# EAGLE design trigger_pickoff (EAGLE 9.2.2)
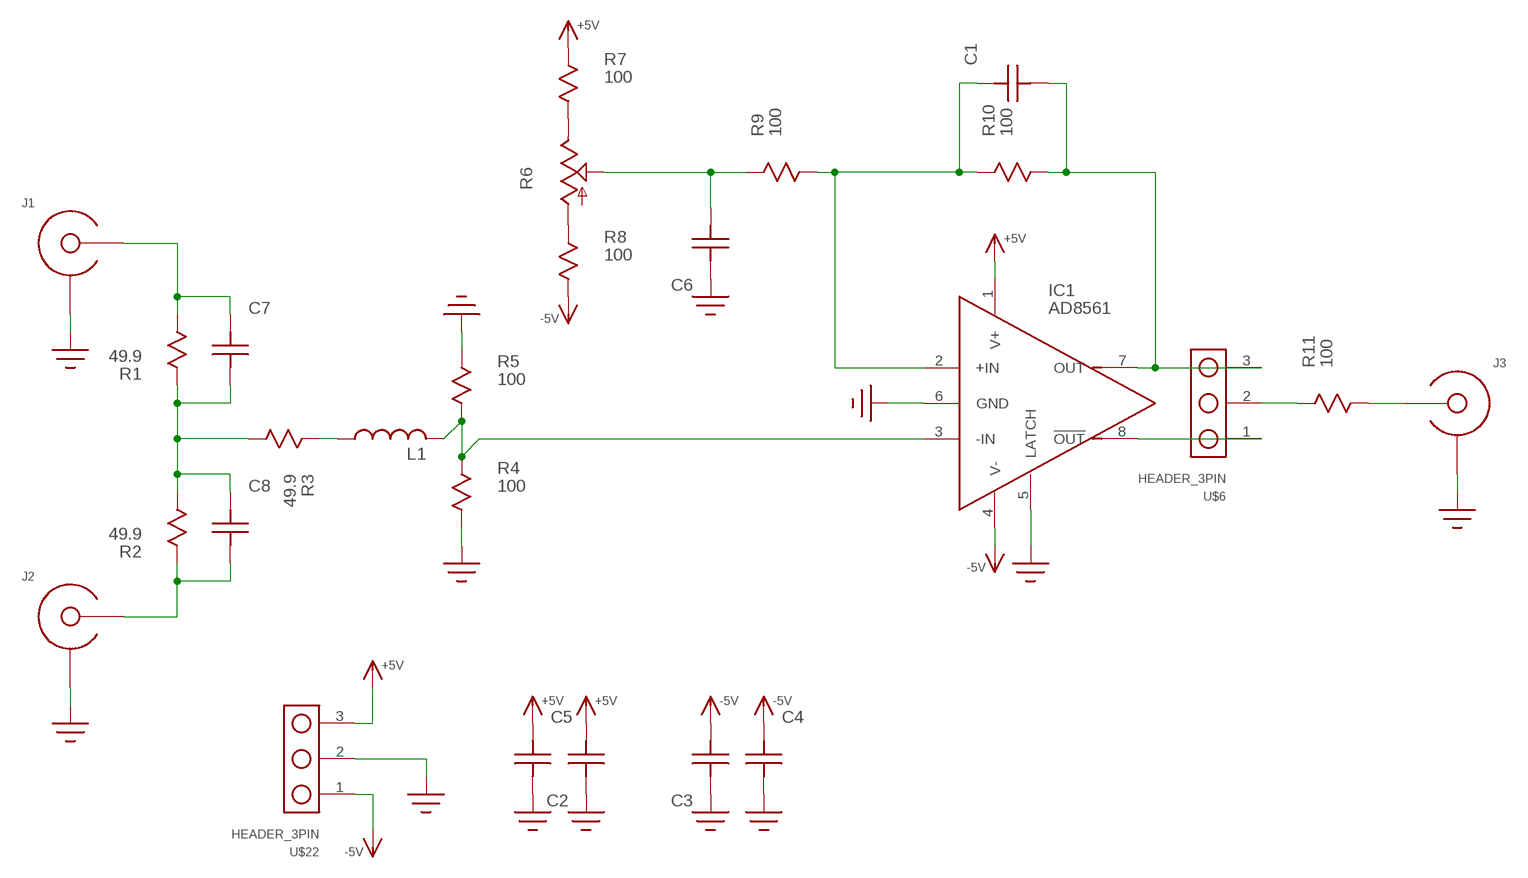
[diagram p0: schematic, sheet 1]

## Parts
C1  C0603  [C0603]
C2  C0603  [C0603]
C3  C0603  [C0603]
C4  C0805  [0805]
C5  C0805  [0805]
C6  C0603  [C0603]
C7  C0603  [C0603]
C8  C0603  [C0603]
IC1  AD8561  [SOIC8]
J1  EDGE_LAUNCH_JACK  [EDGE_LAUNCH_RF_CON]
J2  EDGE_LAUNCH_JACK  [EDGE_LAUNCH_RF_CON]
J3  EDGE_LAUNCH_JACK  [EDGE_LAUNCH_RF_CON]
L1  INDUCTOR  [R0603]
R1  49.9  R0603  [R0603]
R2  49.9  R0603  [R0603]
R3  49.9  R0603  [R0603]
R4  100  R0603  [R0603]
R5  100  R0603  [R0603]
R6  TRIM_US-SP19L  [SP19L]
R7  100  R0603  [R0603]
R8  100  R0603  [R0603]
R9  100  R0603  [R0603]
R10  100  R0603  [R0603]
R11  100  R0603  [R0603]
U$6  HEADER_3PIN  [HEADER_3PIN]
U$22  HEADER_3PIN  [HEADER_3PIN]

## Nets
+5V: C2.P$1 C5.P$2 IC1.1(V+) R7.P$1 U$22.3
-5V: C3.P$1 C4.P$2 IC1.4(V-) R8.P$2 U$22.1
GND: C2.P$2 C3.P$2 C4.P$1 C5.P$1 C6.P$2 IC1.5(LATCH) IC1.6(GND) J1.GND@1(SHIELD) J1.GND@2(SHIELD) J1.GND@3(SHIELD) J1.GND@4(SHIELD) J1.GND@5(SHIELD) J1.GND@6(SHIELD) J1.GND@7(SHIELD) J1.GND@8(SHIELD) J1.GND@9(SHIELD) J1.GND@10(SHIELD) J1.GND@11(SHIELD) J1.GND@12(SHIELD) J1.SHIELD@1(SHIELD) J1.SHIELD@2(SHIELD) J2.GND@1(SHIELD) J2.GND@2(SHIELD) J2.GND@3(SHIELD) J2.GND@4(SHIELD) J2.GND@5(SHIELD) J2.GND@6(SHIELD) J2.GND@7(SHIELD) J2.GND@8(SHIELD) J2.GND@9(SHIELD) J2.GND@10(SHIELD) J2.GND@11(SHIELD) J2.GND@12(SHIELD) J2.SHIELD@1(SHIELD) J2.SHIELD@2(SHIELD) J3.GND@1(SHIELD) J3.GND@2(SHIELD) J3.GND@3(SHIELD) J3.GND@4(SHIELD) J3.GND@5(SHIELD) J3.GND@6(SHIELD) J3.GND@7(SHIELD) J3.GND@8(SHIELD) J3.GND@9(SHIELD) J3.GND@10(SHIELD) J3.GND@11(SHIELD) J3.GND@12(SHIELD) J3.SHIELD@1(SHIELD) J3.SHIELD@2(SHIELD) R4.P$2 R5.P$1 U$22.2
N$1: C7.P$2 J1.CENTER R1.P$2
N$2: C7.P$1 C8.P$2 R1.P$1 R2.P$2 R3.P$2
N$3: C8.P$1 J2.CENTER R2.P$1
N$4: IC1.3(-IN) L1.P$2 R4.P$1 R5.P$2
N$5: R11.P$1 U$6.2
N$6: C1.P$1 IC1.7(OUT) R10.P$2 U$6.3
N$7: IC1.8(!OUT!) U$6.1
N$8: R6.E R7.P$2
N$9: R6.A R8.P$1
N$10: C6.P$1 R6.S R9.P$1
N$11: C1.P$2 IC1.2(+IN) R9.P$2 R10.P$1
N$12: J3.CENTER R11.P$2
N$13: L1.P$1 R3.P$1

## Library data of the parts
C1-C8 = yapo:C
IC1 = yapo:AD8561
J1-J3 = yapo:EDGE_LAUNCH_JACK
L1 = yapo:INDUCTOR
R1-R5 R7-R11 = yapo:R
R6 = pot:TRIM_US-: POTENTIOMETER
U$6 U$22 = yapo:HEADER_3PIN

## Board
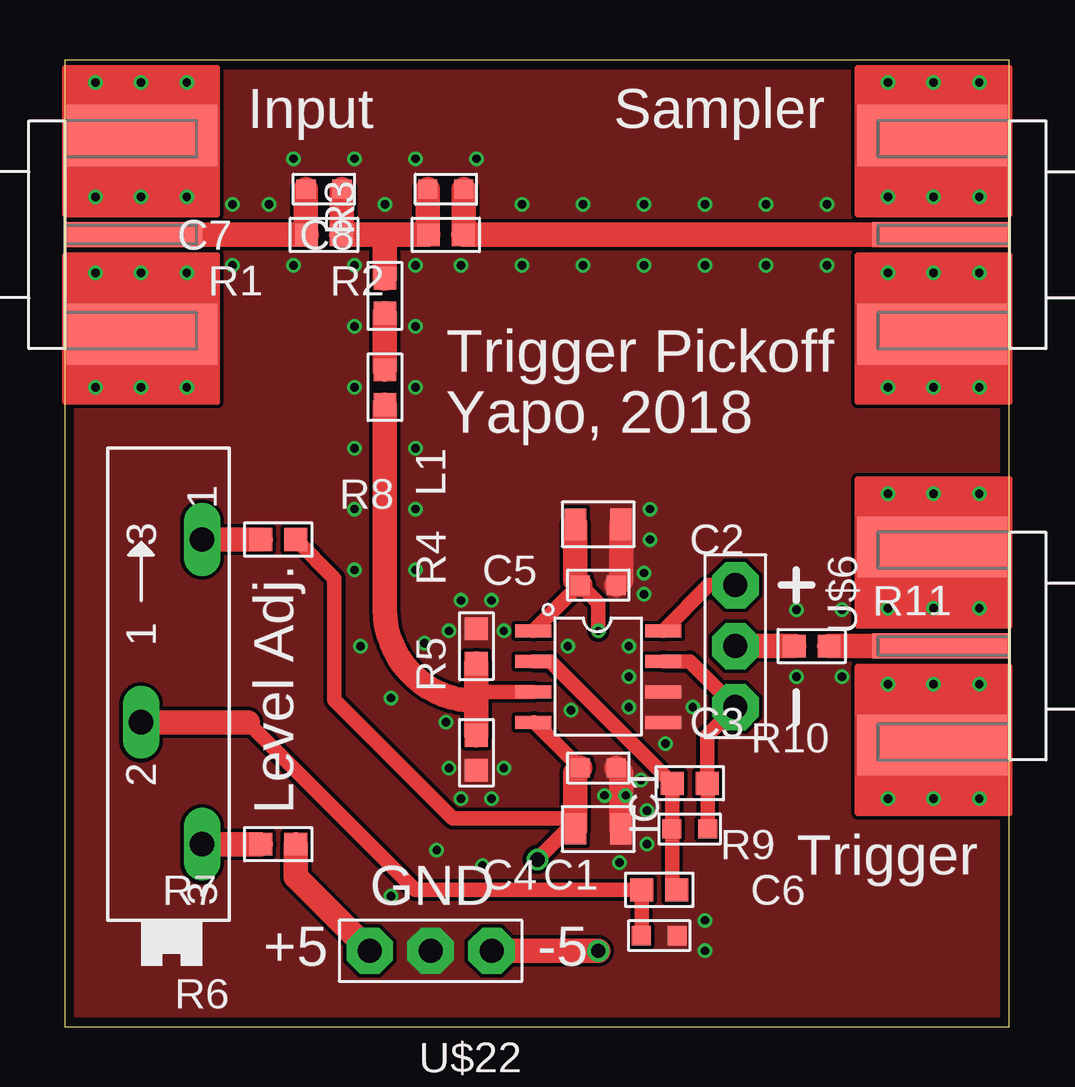
[diagram p1: board, top side]
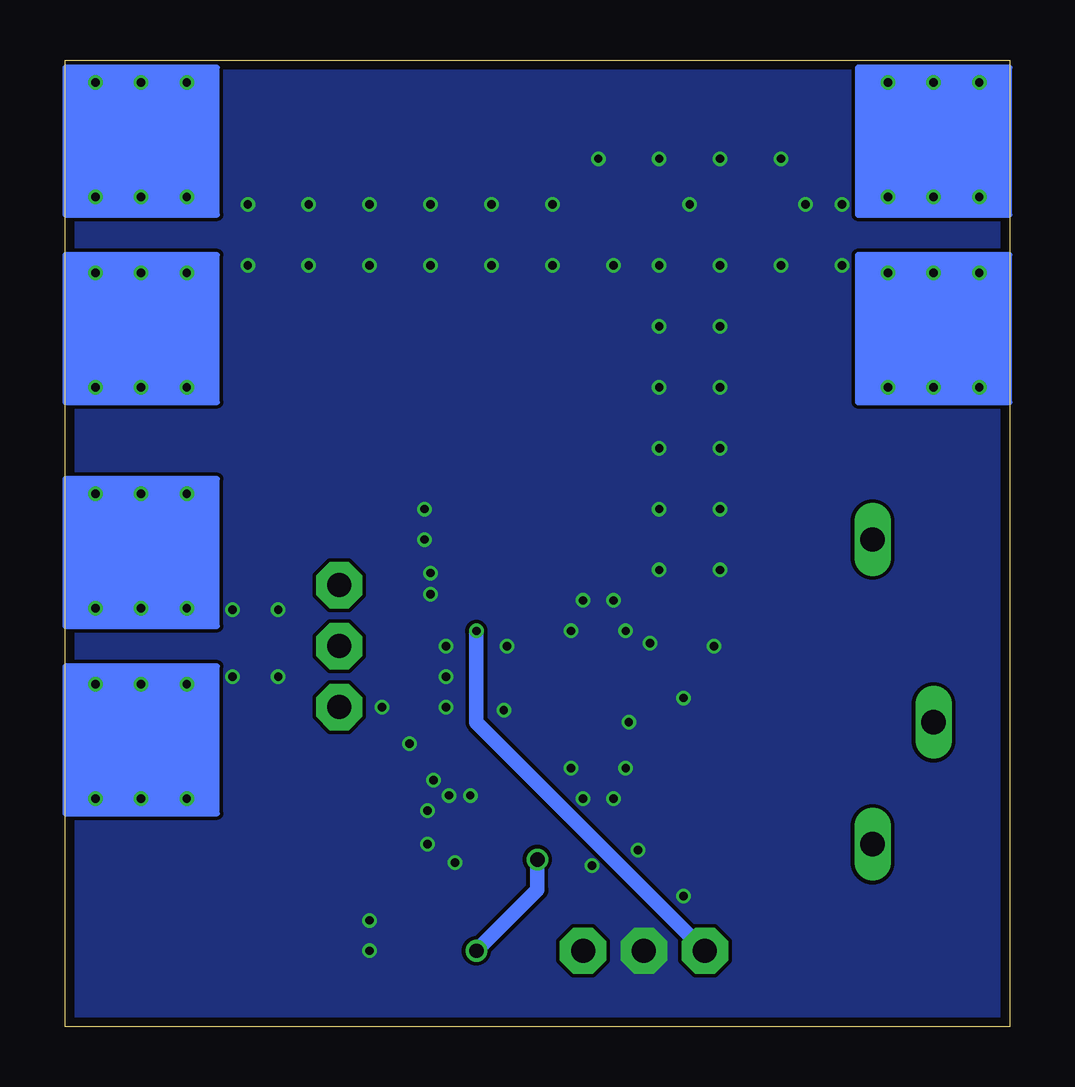
[diagram p2: board, bottom side, seen from below]

Size 39.35 x 40.31 mm. Coordinates in mm from the lower left corner, seen from the top.
Outline: 0,0 39.35,0 39.35,40.31 0,40.31 0,0
Copper layers (1*16): Top 0.035559375mm / dielectric 1.6mm / Bottom 0.035559375mm
Design rules "oshpark-2layer *": minimum track width 6mil, minimum drill 10mil, track to track 6mil, track to pad 6mil, pad to pad 6mil, via to via 6mil, smd to smd 6mil, copper to edge 15mil, drill to drill 6mil, minimum pad ring 5mil, minimum via ring 5mil, stop-mask expansion 2.5mil, vias tented up to drill 20mil, thermal gap 10mil
tRestrict: area 12.7,29.8 to 14,31.1; area 12.7,26 to 14,27.3; area 10.2,32.4 to 11.4,35.6; area 15.2,32.4 to 16.5,35.6; area 30.5,15.2 to 31.8,16.5

### Footprints (pad centres in the part's own frame; a part is rotated, then mirrored left to right if it is on the bottom)
C0603 = smd 0.8 x 0.8: P$1 -0.75,0; P$2 0.75,0
0805 = smd 0.9 x 1.3: P$1 -0.95,0; P$2 0.95,0
SOIC8 = smd 0.55 x 1.5: 1 -1.905,-2.7; 2 -0.635,-2.7; 3 0.635,-2.7; 4 1.905,-2.7; 5 1.905,2.7; 6 0.635,2.7; 7 -0.635,2.7; 8 -1.905,2.7
EDGE_LAUNCH_RF_CON = smd 5.715 x 1.041: CENTER -2.875,0 | drill 0.35: GND@1 -5.08,1.587; GND@2 -3.175,1.587; GND@3 -1.27,1.587; GND@4 -5.08,-1.587; GND@5 -3.175,-1.587; GND@6 -1.27,-1.587; GND@7 -5.08,6.35; GND@8 -3.175,6.35; GND@9 -1.27,6.35; GND@10 -5.08,-6.35; GND@11 -3.175,-6.35; GND@12 -1.27,-6.35 | smd 6.35 x 2.54: SHIELD@1 -3.175,-4.128; SHIELD@2 -3.175,4.128
R0603 = smd 0.95 x 0.95: P$1 -0.725,0; P$2 0.725,0
SP19L = drill 1.016 long: A 5.715,-1.27; E -6.985,-1.27; S -1.905,1.27
HEADER_3PIN = drill 1 pad 1.93 octagon: 1 -2.54,0; 2 0,0; 3 2.54,0

### Placement (x,y rotation side)
C1  26.04,8.26 180 top
C2  22.23,18.41 0 top
C3  22.23,10.79 0 top
C4  22.23,8.26 180 top
C5  22.23,20.95 180 top
C6  24.77,3.81 0 top
C7  10.79,34.92 180 top
C8  15.88,34.92 180 top
IC1  22.23,14.61 270 top
J1  0,33.02 180 top
J2  39.37,33.02 0 top
J3  39.37,15.88 0 top
L1  13.34,26.67 270 top
R1  10.79,33.02 180 top
R2  15.88,33.02 180 top
R3  13.34,30.48 90 top
R4  17.14,15.88 90 top
R5  17.14,11.43 90 top
R6  4.45,14.61 90 top
R7  8.89,7.62 180 top
R8  8.89,20.32 0 top
R9  24.77,5.71 0 top
R10  26.04,10.16 0 top
R11  31.11,15.88 0 top
U$6  27.94,15.88 270 top
U$22  15.24,3.17 180 top

### Tracks (layer width: path | path; a pad name or v marks a point on that pad's centre or on a via)
+5V  (via drill 0.35)
  Top 0.61: IC1.1 21.27,18.26 21.27,18.61 | C2.P$1 22.23,17.66 v22.23,16.51
  Top 1.016: C5.P$2 21.27,18.61 C2.P$1 | U$22.3 9.62,6.26 R7.P$1
  Bottom 0.61: v22.23,16.51 22.23,12.7 U$22.3
-5V  (via drill 0.6)
  Top 0.61: C3.P$1 19.57,12.7 IC1.4 | C4.P$2 21.27,8.66 21.25,8.69 20.95,8.69 | R8.P$2 11.23,18.7 11.23,13.62 16.16,8.69 20.95,8.69 | v19.68,6.99 20.95,8.26 20.95,8.69
  Top 1.016: C4.P$2 21.27,10.6 C3.P$1 | U$22.1 v22.23,3.17
  Bottom 0.61: v22.23,3.17 19.68,5.71 v19.68,6.99
GND  (via drill 0.35)
  Top 1.016: C5.P$1 23.18,18.61 C2.P$2 | C4.P$1 23.18,10.6 C3.P$2
  other vias: 16.51,9.53 17.78,9.53 16.51,17.78 17.78,17.78 24.38,21.59 24.38,20.32 24.13,18.92 24.13,18.03 22.48,9.65 23.37,9.65 21.08,13.21 24.26,7.62 26.67,4.45 26.67,3.17 23.5,14.61 23.5,13.34 26.16,13.34 25.02,11.81 15.88,12.7 13.59,13.72 12.32,15.88 12.06,19.05 12.06,21.59 12.06,24.13 12.06,26.67 12.06,29.21 12.06,31.75 9.53,31.75 6.99,31.75 6.99,34.29 9.53,36.2 12.06,36.2 14.61,36.2 17.14,36.2 19.05,34.29 21.59,34.29 24.13,34.29 26.67,34.29 29.21,34.29 31.75,34.29 31.75,31.75 29.21,31.75 26.67,31.75 24.13,31.75 21.59,31.75 19.05,31.75 16.51,31.75 14.61,29.21 14.61,26.67 14.61,24.13 14.61,21.59 14.61,19.05 14.99,16 14.61,31.75 24,10.29 24.26,9.02 16,16.51 18.29,16.51 18.29,10.79 16,10.79 23.11,6.86 32.38,17.4 30.48,17.4 30.48,14.61 32.38,14.61 8.51,34.29 13.34,34.29 20.95,15.88 13.59,5.46 23.5,15.88 15.49,7.37 17.4,6.73
  pour Top (no thermals): 0,0 39.37,0 39.37,40.64 0,40.64
  pour Bottom (no thermals): 0,0 39.37,0 39.37,40.64 0,40.64
N$1
  Top 1.016: J1.CENTER R1.P$2 10.04,33.05 C7.P$2
N$2
  Top 1.016: 13.34,33.02 R1.P$1 11.54,33.05 C7.P$1 | 13.34,33.02 R2.P$2 15.12,33.05 C8.P$2 | R3.P$2 13.34,33.02
N$3
  Top 1.016: J2.CENTER R2.P$1 16.62,33.05 C8.P$1
N$4
  Top 0.61: IC1.3 17.14,13.97
  Top 1.016: R4.P$1 17.14,13.97 17.14,13.59 | 17.14,13.59 R5.P$2 | 17.14,13.59 arc-90 13.34,17.4 L1.P$2
N$5
  Top 1.016: R11.P$1 U$6.2
N$6
  Top 0.61: IC1.7 26.04,15.24 U$6.3 26.76,12.15 R10.P$2 26.79,10.13 C1.P$1
N$7
  Top 0.61: IC1.8 26.83,18.41 U$6.1
N$8
  Top 1.016: R6.E R7.P$2
N$9
  Top 1.016: R6.A R8.P$1
N$10
  Top 0.61: C6.P$1 24.04,3.83 R9.P$1 14.61,5.71 7.62,12.7
  Top 1.016: R6.S 7.62,12.7
N$11
  Top 0.61: IC1.2 20.23,15.24 R10.P$1 25.31,8.28 | 25.31,8.28 C1.P$2 | R9.P$2 25.31,5.89 25.31,8.28
N$12
  Top 1.016: R11.P$2 J3.CENTER
N$13
  Top 1.016: R3.P$1 L1.P$1

### Text on the board
tPlace: Input | Sampler | Trigger Pickoff | Yapo, 2018 | Level Adj. | Trigger | GND | +5 | -5